# EAGLE design schemat (EAGLE 8.6.0)
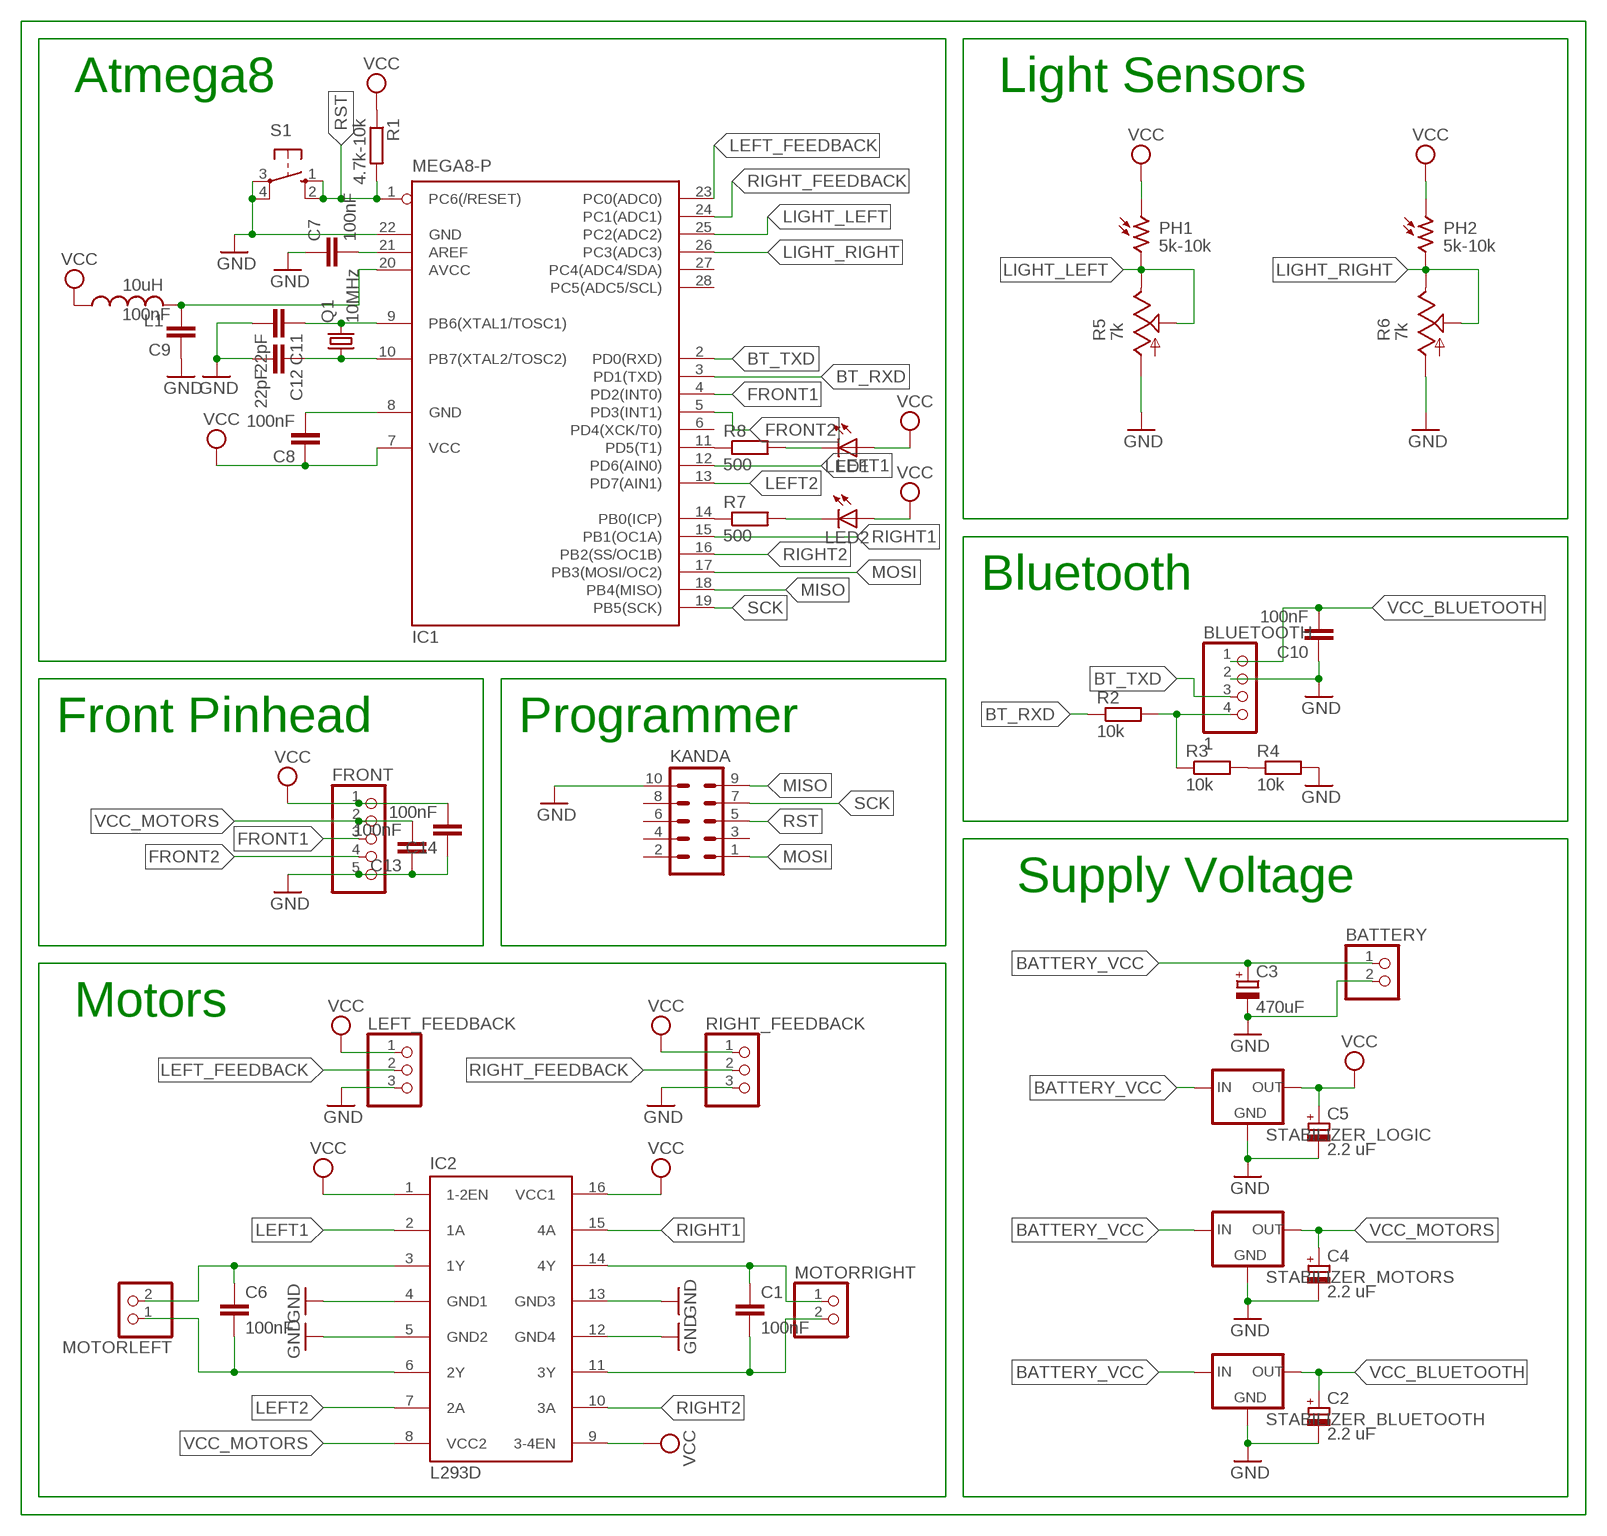
[diagram p0: schematic, sheet 1]

## Parts
BATTERY  PINHD-1X2  [1X02]
BLUETOOTH  1  PINHD-1X4  [1X04]
C1  100nF  C2,5-3  [C2.5-3]
C2  2.2 uF  CPOL-EUE1.8-4  [E1,8-4]
C3  470uF  CPOL-EUE3.5-8  [E3,5-8]
C4  2.2 uF  CPOL-EUE1.8-4  [E1,8-4]
C5  2.2 uF  CPOL-EUE1.8-4  [E1,8-4]
C6  100nF  C2,5-3  [C2.5-3]
C7  100nF  C2,5-3  [C2.5-3]
C8  100nF  C2,5-3  [C2.5-3]
C9  100nF  C2,5-3  [C2.5-3]
C10  100nF  C2,5-3  [C2.5-3]
C11  22pF  C2,5-3  [C2.5-3]
C12  22pF  C2,5-3  [C2.5-3]
C13  100nF  C2,5-3  [C2.5-3]
C14  100nF  C2,5-3  [C2.5-3]
FRONT  PINHD-1X5  [1X05]
IC1  MEGA8-P  [DIL28-3]
IC2  L293D  [DIL16]
KANDA  ML10  [ML10]
L1  10uH  L-US0204/7  [0204/7]
LED1  LEDSFH480  [SFH480]
LED2  LEDSFH480  [SFH480]
LEFT_FEEDBACK  PINHD-1X3  [1X03]
MOTORLEFT  PINHD-1X2  [1X02]
MOTORRIGHT  PINHD-1X2  [1X02]
PH1  5k-10k  VT83N2  [VT800]
PH2  5k-10k  VT83N2  [VT800]
Q1  10MHz  CRYSTALHC49U-V  [HC49U-V]
R1  4.7k-10k  R-EU_0204/7  [0204/7]
R2  10k  R-EU_0204/7  [0204/7]
R3  10k  R-EU_0204/7  [0204/7]
R4  10k  R-EU_0204/7  [0204/7]
R5  7k  TRIM_US-CA6V  [CA6V]
R6  7k  TRIM_US-CA6V  [CA6V]
R7  500  R-EU_0204/7  [0204/7]
R8  500  R-EU_0204/7  [0204/7]
RIGHT_FEEDBACK  PINHD-1X3  [1X03]
S1  10-XX  [B3F-10XX]
STABILIZER_BLUETOOTH  78XXS  [78XXS]
STABILIZER_LOGIC  78XXS  [78XXS]
STABILIZER_MOTORS  78XXS  [78XXS]

## Nets
BATTERY_VCC: BATTERY.1 C3.+ STABILIZER_BLUETOOTH.IN STABILIZER_LOGIC.IN STABILIZER_MOTORS.IN
BT_RXD: IC1.3(PD1(TXD)) R2.1
BT_TXD: BLUETOOTH.3 IC1.2(PD0(RXD))
FRONT1: FRONT.3 IC1.4(PD2(INT0))
FRONT2: FRONT.4 IC1.5(PD3(INT1))
GND: BATTERY.2 BLUETOOTH.2 C2.- C3.- C4.- C5.- C7.1 C9.1 C10.1 C11.2 C12.2 C13.1 C14.1 FRONT.5 IC1.22(GND) IC2.4(GND1) IC2.5(GND2) IC2.12(GND4) IC2.13(GND3) KANDA.10 LEFT_FEEDBACK.3 R4.2 R5.A R6.A RIGHT_FEEDBACK.3 S1.3(P) S1.4(P1) STABILIZER_BLUETOOTH.GND STABILIZER_LOGIC.GND STABILIZER_MOTORS.GND
LEFT1: IC1.12(PD6(AIN0)) IC2.2(1A)
LEFT2: IC1.13(PD7(AIN1)) IC2.7(2A)
LEFT_FEEDBACK: IC1.23(PC0(ADC0)) LEFT_FEEDBACK.2
LIGHT_LEFT: IC1.25(PC2(ADC2)) PH1.2 R5.E R5.S
LIGHT_RIGHT: IC1.26(PC3(ADC3)) PH2.2 R6.E R6.S
MISO: IC1.18(PB4(MISO)) KANDA.9
MOSI: IC1.17(PB3(MOSI/OC2)) KANDA.1
N$2: C7.2 IC1.21(AREF)
N$3: C6.1 IC2.3(1Y) MOTORLEFT.2
N$4: C6.2 IC2.6(2Y) MOTORLEFT.1
N$5: C1.1 IC2.14(4Y) MOTORRIGHT.1
N$6: C1.2 IC2.11(3Y) MOTORRIGHT.2
N$7: C9.2 IC1.20(AVCC) L1.2
N$8: C8.2 IC1.8(GND)
N$9: R3.2 R4.1
N$10: BLUETOOTH.4 R2.2 R3.1
N$12: C12.1 IC1.10(PB7(XTAL2/TOSC2)) Q1.1
N$13: C11.1 IC1.9(PB6(XTAL1/TOSC1)) Q1.2
N$20: IC1.14(PB0(ICP)) R7.1
N$21: IC1.11(PD5(T1)) R8.1
N$22: LED2.K(C) R7.2
N$23: LED1.K(C) R8.2
RIGHT1: IC1.15(PB1(OC1A)) IC2.15(4A)
RIGHT2: IC1.16(PB2(SS/OC1B)) IC2.10(3A)
RIGHT_FEEDBACK: IC1.24(PC1(ADC1)) RIGHT_FEEDBACK.2
RST: IC1.1(PC6(/RESET)) KANDA.5 R1.2 S1.1(S) S1.2(S1)
SCK: IC1.19(PB5(SCK)) KANDA.7
VCC: C5.+ C8.1 C14.2 FRONT.1 IC1.7(VCC) IC2.1(1-2EN) IC2.9(3-4EN) IC2.16(VCC1) L1.1 LED1.A LED2.A LEFT_FEEDBACK.1 PH1.1 PH2.1 R1.1 RIGHT_FEEDBACK.1 STABILIZER_LOGIC.OUT
VCC_BLUETOOTH: BLUETOOTH.1 C2.+ C10.2 STABILIZER_BLUETOOTH.OUT
VCC_MOTORS: C4.+ C13.2 FRONT.2 IC2.8(VCC2) STABILIZER_MOTORS.OUT
Unconnected: IC1.6(PD4(XCK/T0)) IC1.27(PC4(ADC4/SDA)) IC1.28(PC5(ADC5/SCL)) KANDA.2 KANDA.3 KANDA.4 KANDA.6 KANDA.8

## Notes on the sheet
- Atmega8 | Light Sensors
- Bluetooth
- Front Pinhead | Programmer
- Supply Voltage
- Motors

## Library data of the parts
BATTERY MOTORLEFT MOTORRIGHT = pinhead:PINHD-1X2: PIN HEADER
BLUETOOTH = pinhead:PINHD-1X4: PIN HEADER
C1 C6-C14 = capacitor-wima:C: CAPACITOR naming: grid - package width
C2-C5 = rcl:CPOL-EU: POLARIZED CAPACITOR, European symbol; SPICEPREFIX: C
FRONT = pinhead:PINHD-1X5: PIN HEADER
IC1 = atmel:MEGA8-P: MICROCONTROLLER 8 Kbytes FLASH, 1 kbytes SRAM, 512 bytes EEPROM, USART, 4-channel 10 bit ADC, 2-channel 8 bit ADC Pin compatible with Atmega48, ATMega88, ATMega168 Source: avr.lbr; OC_FARNELL: unknown; OC_NEWARK: unknown
IC2 = st-microelectronics:L293D: PUSH-PULL 4 CHANNEL DRIVER; MPN: L293D; OC_FARNELL: 9589619; OC_NEWARK: 56P8249
KANDA = con-ml:ML10: HARTING; OC_FARNELL: unknown; OC_NEWARK: unknown
L1 = rcl:L-US: INDUCTOR, American symbol; SPICEPREFIX: L
LED1 LED2 = led:LED: LED OSRAM: - CHIPLED LG R971, LG N971, LY N971, LG Q971, LY Q971, LO R971, LY R971 LH N974, LH R974 LS Q976, LO Q976, LY Q976 LO Q996 - Hyper CHIPLED LW Q18S LB Q993, LB Q99A, LB R99A - SideLED LS A670, LO A670, LY A670, LG A670, LP A670 LB A673, LV A673, LT A673, LW A673 LH A674 LY A675 LS A676, LA A676, LO A676, LY A676, LW A676 LS A679, LY A679, LG A679 - Hyper Micro SIDELED® LS Y876, LA Y876, LO Y876, LY Y876 LT Y87S - SmartLED LW L88C, LW L88S LB L89C, LB L89S, LG L890 LS L89K, LO L89K, LY L89K LS L896, LA L896, LO L896, LY L896 - TOPLED LS T670, LO T670, LY T670, LG T670, LP T670 LSG T670, LSP T670, LSY T670, LOP T670, LYG T670 LG T671, LOG T671, LSG T671 LB T673, LV T673, LT T673, LW T673 LH T674 LS T676, LA T676, LO T676, LY T676, LB T676, LH T676, LSB T676, LW T676 LB T67C, LV T67C, LT T67C, LS T67K, LO T67K, LY T67K, LW E67C LS E67B, LA E67B, LO E67B, LY E67B, LB E67C, LV E67C, LT E67C LW T67C LS T679, LY T679, LG T679 LS T770, LO T770, LY T770, LG T770, LP T770 LB T773, LV T773, LT T773, LW T773 LH T774 LS E675, LA E675, LY E675, LS T675 LS T776, LA T776, LO T776, LY T776, LB T776 LHGB T686 LT T68C, LB T68C - Hyper Mini TOPLED® LB M676 - Mini TOPLED Santana® LG M470 LS M47K, LO M47K, LY M47K Source: http://www.osram.convergy.de LUXEON: - LUMILED® LXK2-PW12-R00, LXK2-PW12-S00, LXK2-PW14-U00, LXK2-PW14-V00 LXK2-PM12-R00, LXK2-PM12-S00, LXK2-PM14-U00 LXK2-PE12-Q00, LXK2-PE12-R00, LXK2-PE12-S00, LXK2-PE14-T00, LXK2-PE14-U00 LXK2-PB12-K00, LXK2-PB12-L00, LXK2-PB12-M00, LXK2-PB14-N00, LXK2-PB14-P00, LXK2-PB14-Q00 LXK2-PR12-L00, LXK2-PR12-M00, LXK2-PR14-Q00, LXK2-PR14-R00 LXK2-PD12-Q00, LXK2-PD12-R00, LXK2-PD12-S00 LXK2-PH12-R00, LXK2-PH12-S00 LXK2-PL12-P00, LXK2-PL12-Q00, LXK2-PL12-R00 Source: www.luxeon.com KINGBRIGHT: KA-3528ASYC Source: www.kingbright.com
LEFT_FEEDBACK RIGHT_FEEDBACK = pinhead:PINHD-1X3: PIN HEADER
PH1 PH2 = photo-elements:VT8: Photoconductive Cell VT800 Series Source: http://optoelectronics.perkinelmer.com/content/Datasheets/DTS_vt800seriesdatasheet.pdf
Q1 = crystal:CRYSTAL: CRYSTAL; OC_FARNELL: 1666969; OC_NEWARK: unknown
R1-R4 R7 R8 = rcl:R-EU_: RESISTOR, European symbol; SPICEPREFIX: R
R5 R6 = pot:TRIM_US-: POTENTIOMETER
S1 = switch-omron:10-XX: OMRON SWITCH; MPN: B3F-1000; OC_FARNELL: 176432; OC_NEWARK: 36M3542
STABILIZER_BLUETOOTH STABILIZER_LOGIC STABILIZER_MOTORS = v-reg:78XXS: VOLTAGE REGULATOR

## Board
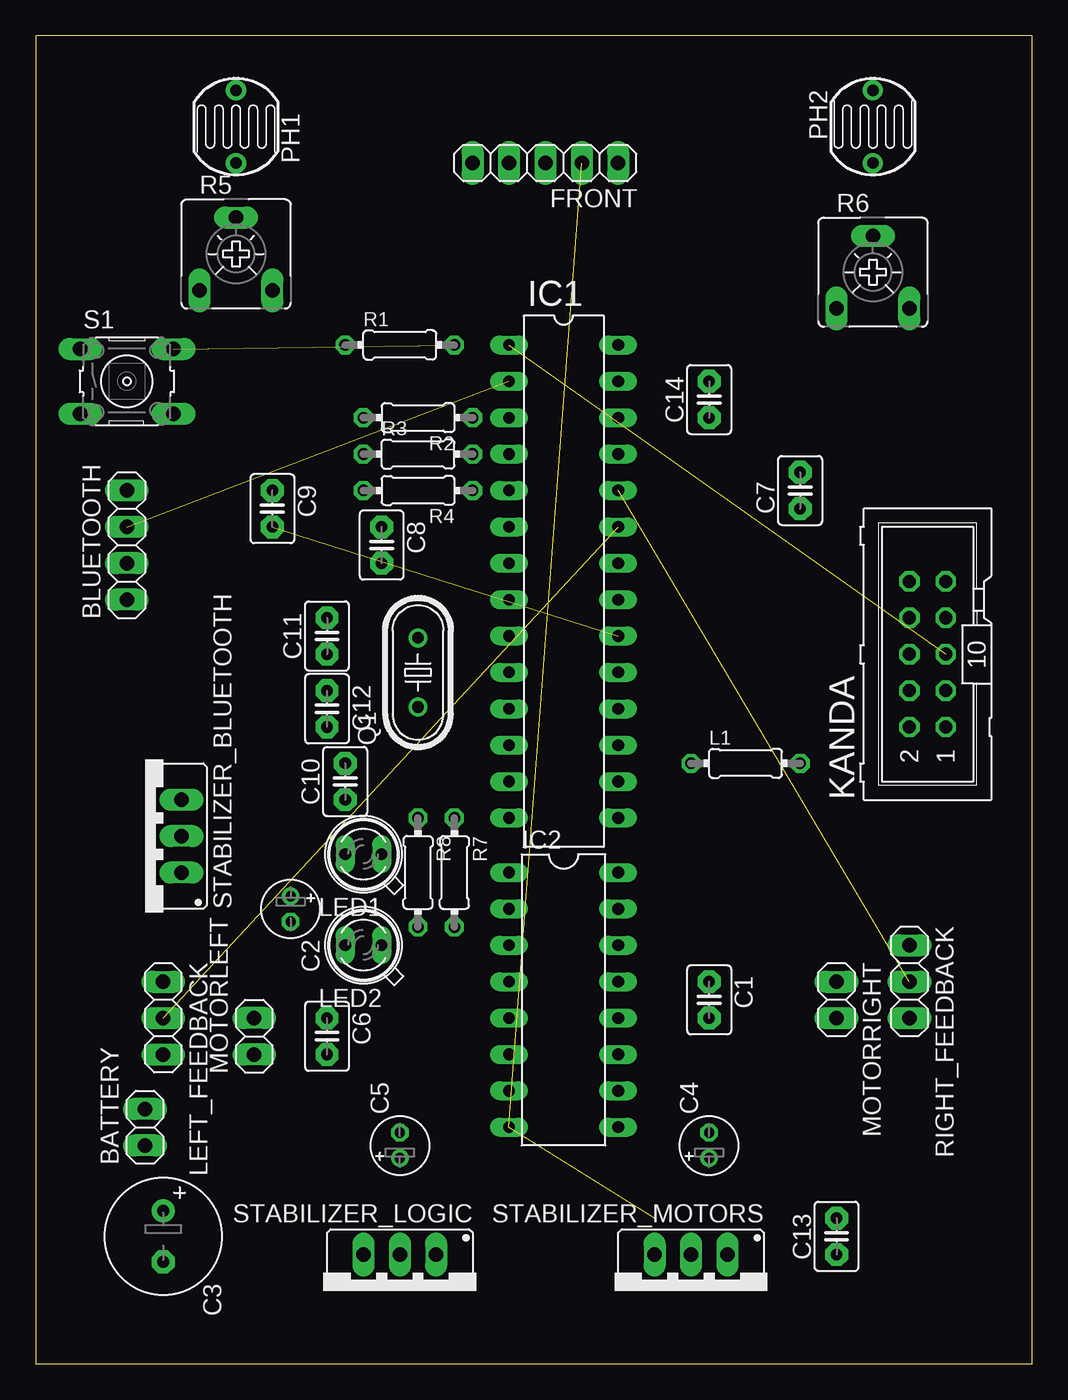
[diagram p1: board, top side]
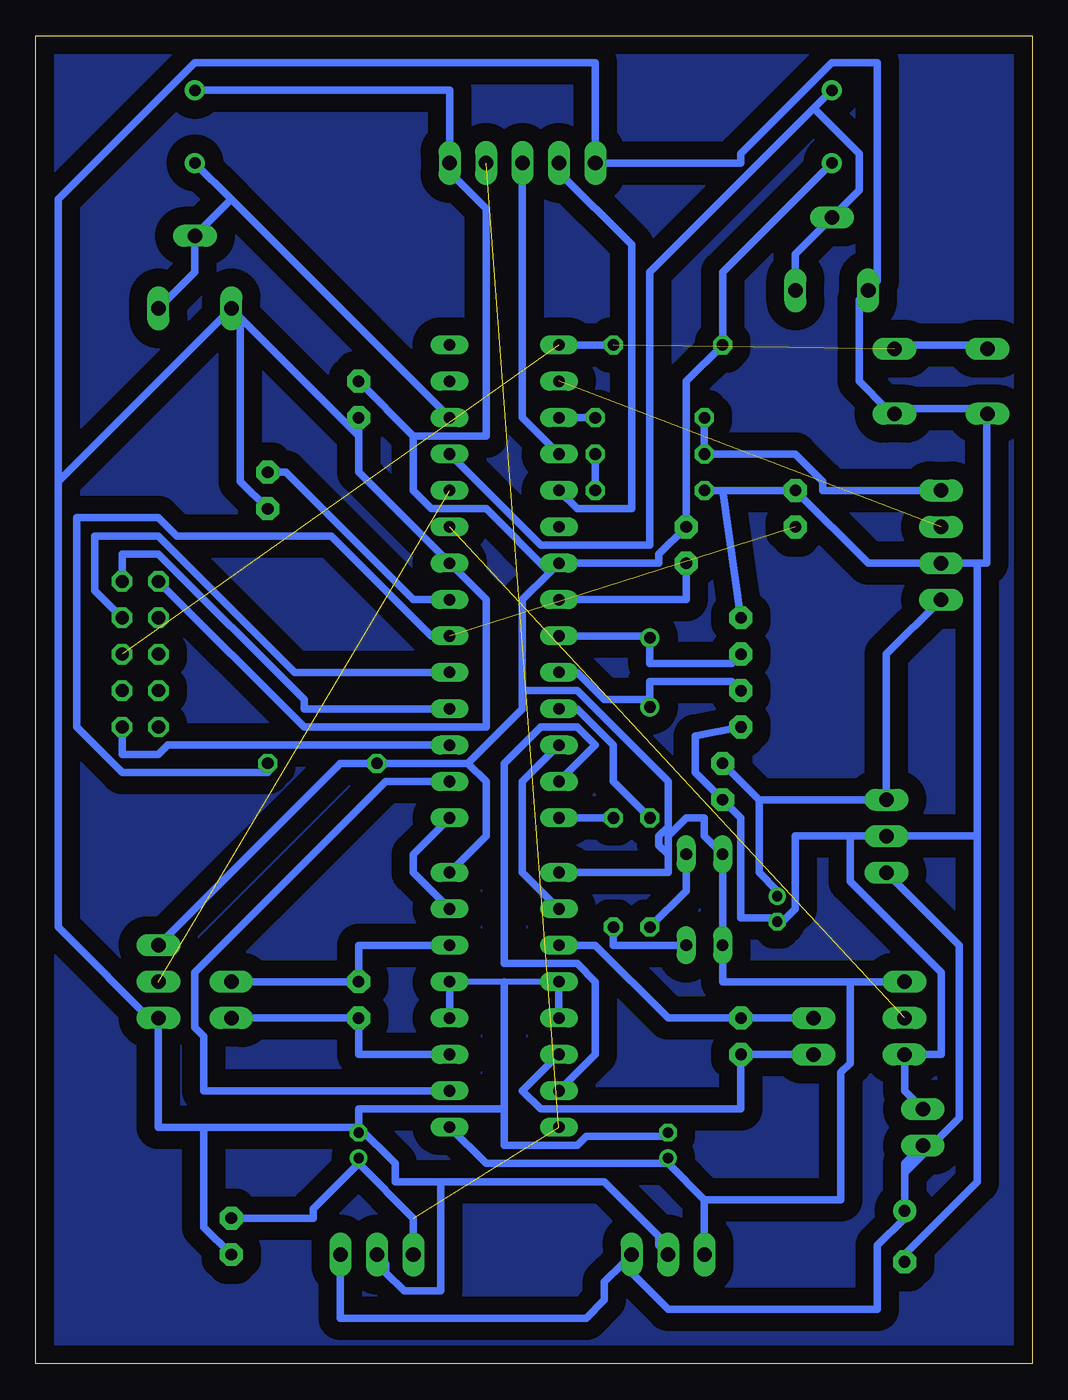
[diagram p2: board, bottom side, seen from below]

Size 69.52 x 92.7 mm. Coordinates in mm from the lower left corner, seen from the top.
Outline: 0,0 69.52,0 69.52,92.7 0,92.7 0,0
Copper layers (1*16): Top 0.035mm / dielectric 1.5mm / Bottom 0.035mm
Design rules "default *": minimum track width 20mil, minimum drill 24mil, track to track 14mil, track to pad 14mil, pad to pad 14mil, via to via 8mil, smd to smd 8mil, copper to edge 40mil, drill to drill 8mil, minimum pad ring 10mil, minimum via ring 8mil, stop-mask expansion 4mil, vias tented up to drill 0mil, thermal gap 10mil

### Footprints (pad centres in the part's own frame; a part is rotated, then mirrored left to right if it is on the bottom)
1X02 = drill 1.016 long: 1 -1.27,0; 2 1.27,0
1X04 = drill 1.016 long: 1 -3.81,0; 2 -1.27,0; 3 1.27,0; 4 3.81,0
C2.5-3 = drill 0.813 pad 1.6 octagon: 1 -1.27,0; 2 1.27,0
E1,8-4 = drill 0.711 pad 1.168: + -0.889,0 | drill 0.711 pad 1.168 octagon: - 0.889,0
E3,5-8 = drill 0.813 pad 1.6: + -1.778,0 | drill 0.813 pad 1.6 octagon: - 1.778,0
1X05 = drill 1.016 long: 1 -5.08,0; 2 -2.54,0; 3 0,0; 4 2.54,0; 5 5.08,0
DIL28-3 = drill 0.813 long: 1 -16.51,-3.81; 2 -13.97,-3.81; 3 -11.43,-3.81; 4 -8.89,-3.81; 5 -6.35,-3.81; 6 -3.81,-3.81; 7 -1.27,-3.81; 8 1.27,-3.81; 9 3.81,-3.81; 10 6.35,-3.81; 11 8.89,-3.81; 12 11.43,-3.81; 13 13.97,-3.81; 14 16.51,-3.81; 15 16.51,3.81; 16 13.97,3.81; 17 11.43,3.81; 18 8.89,3.81; 19 6.35,3.81; 20 3.81,3.81; 21 1.27,3.81; 22 -1.27,3.81; 23 -3.81,3.81; 24 -6.35,3.81; 25 -8.89,3.81; 26 -11.43,3.81; 27 -13.97,3.81; 28 -16.51,3.81
DIL16 = drill 0.813 long: 1 -8.89,-3.81; 2 -6.35,-3.81; 3 -3.81,-3.81; 4 -1.27,-3.81; 5 1.27,-3.81; 6 3.81,-3.81; 7 6.35,-3.81; 8 8.89,-3.81; 9 8.89,3.81; 10 6.35,3.81; 11 3.81,3.81; 12 1.27,3.81; 13 -1.27,3.81; 14 -3.81,3.81; 15 -6.35,3.81; 16 -8.89,3.81
ML10 = drill 0.914 octagon: 1 -5.08,-1.27; 2 -5.08,1.27; 3 -2.54,-1.27; 4 -2.54,1.27; 5 0,-1.27; 6 0,1.27; 7 2.54,-1.27; 8 2.54,1.27; 9 5.08,-1.27; 10 5.08,1.27
0204/7 = drill 0.813 octagon: 1 -3.81,0; 2 3.81,0
SFH480 = drill 0.813 long: A 1.27,0; K -1.27,0
1X03 = drill 1.016 long: 1 -2.54,0; 2 0,0; 3 2.54,0
VT800 = drill 0.8 pad 1.4: 1 -2.54,0; 2 2.54,0
HC49U-V = drill 0.813: 1 -2.413,0; 2 2.413,0
CA6V = drill 1.016 long: A -2.54,-2.54; E 2.54,-2.54; S 0,2.54
B3F-10XX = drill 1.016 long: 1 -3.251,2.261; 2 3.251,2.261; 3 -3.251,-2.261; 4 3.251,-2.261
78XXS = drill 1.016 long: GND 0,-2.54; IN -2.54,-2.54; OUT 2.54,-2.54

### Placement (x,y rotation side)
BATTERY  7.62,16.51 90 top
BLUETOOTH  6.35,57.15 90 top
C1  46.99,25.4 270 top
C2  17.78,31.75 270 top
C3  8.89,8.89 270 top
C4  46.99,15.24 90 top
C5  25.4,15.24 90 top
C6  20.32,22.86 270 top
C7  53.34,60.96 90 top
C8  24.13,57.15 270 top
C9  16.51,59.69 270 top
C10  21.59,40.64 90 top
C11  20.32,50.8 90 top
C12  20.32,45.72 270 top
C13  55.88,8.89 90 top
C14  46.99,67.31 90 top
FRONT  35.56,83.82 180 top
IC1  36.83,54.61 270 top
IC2  36.83,25.4 270 top
KANDA  62.23,49.53 90 top
L1  49.53,41.91 0 top
LED1  22.86,35.56 180 top
LED2  22.86,29.21 180 top
LEFT_FEEDBACK  8.89,24.13 270 top
MOTORLEFT  15.24,22.86 90 top
MOTORRIGHT  55.88,25.4 270 top
PH1  13.97,86.36 90 top
PH2  58.42,86.36 270 top
Q1  26.67,48.26 90 top
R1  25.4,71.12 0 top
R2  26.67,66.04 180 top
R3  26.67,63.5 0 top
R4  26.67,60.96 180 top
R5  13.97,77.47 0 top
R6  58.42,76.2 0 top
R7  29.21,34.29 270 top
R8  26.67,34.29 270 top
RIGHT_FEEDBACK  60.96,26.67 270 top
S1  6.35,68.58 0 top
STABILIZER_BLUETOOTH  7.62,36.83 90 top
STABILIZER_LOGIC  25.4,5.08 180 top
STABILIZER_MOTORS  45.72,5.08 180 top

### Tracks (layer width: path | path; a pad name or v marks a point on that pad's centre or on a via)
BATTERY_VCC
  Bottom 0.508: 28.57,6.99 29.84,5.71 29.84,4.45 31.11,3.17 48.26,3.17 STABILIZER_MOTORS.IN | BATTERY.1 8.89,13.97 8.89,13.34 | 8.89,13.34 C3.+ 8.89,10.16 10.8,8.26 10.8,3.81 25.4,3.81 28.57,6.99 | STABILIZER_BLUETOOTH.IN 5.08,29.21 5.08,17.14 8.89,13.34 | 28.57,6.99 STABILIZER_LOGIC.IN
BT_RXD
  Bottom 0.508: IC1.3 R2.1
BT_TXD  (1 unrouted)
FRONT1
  Bottom 0.508: IC1.4 35.56,66.04 FRONT.3
FRONT2
  Bottom 0.508: IC1.5 31.75,59.69 27.94,59.69 27.94,78.11 33.02,83.19 FRONT.4
GND
  Bottom 0.406: IC2.4 36.83,26.67 IC2.13
  Bottom 0.508: C14.1 46.99,64.77 | 46.99,64.77 46.99,62.23 IC1.22 38.1,53.34 38.1,44.45 50.8,44.45 KANDA.10 | 46.99,64.77 55.24,73.03 | C7.1 55.24,61.59 55.24,73.03 | 55.24,73.03 R6.A 67.95,61.59 | 36.83,26.67 36.83,17.78 | 36.83,17.78 36.83,15.24 31.75,15.24 31.11,15.88 25.4,15.88 C5.- | IC2.4 IC2.5 | IC2.13 IC2.12 | 57.78,16.51 60.96,16.51 60.96,23.5 | 57.78,16.51 46.99,16.51 | STABILIZER_LOGIC.GND 26.04,8.26 26.04,8.89 29.84,12.7 41.27,12.7 | 41.27,12.7 44.45,12.7 44.45,13.97 46.99,16.51 | STABILIZER_MOTORS.GND 45.09,6.99 45.09,6.35 43.81,5.08 41.27,5.08 41.27,12.7 | C13.1 57.78,9.53 57.78,16.51 | 36.83,17.78 46.99,17.78 46.99,16.51 | 46.99,16.51 C4.- | 67.95,61.59 67.95,30.48 60.96,23.5 | 60.96,23.5 RIGHT_FEEDBACK.3 | BATTERY.2 8.89,19.05 LEFT_FEEDBACK.3 6.35,21.59 6.35,27.3 12.7,33.66 12.7,36.83 | 12.7,36.83 16.51,36.83 16.51,31.75 17.78,30.48 C2.- 17.78,31.11 20.32,31.11 20.32,38.1 C10.1 23.49,41.27 23.49,43.81 C12.2 | 12.7,36.83 STABILIZER_BLUETOOTH.GND 3.81,36.83 | 21.59,60.96 C9.1 11.43,55.88 BLUETOOTH.2 3.81,55.88 | 21.59,60.96 R4.2 | 21.59,60.96 C11.2 | 3.81,55.88 3.17,55.88 3.17,66.04 S1.3 3.17,66.67 9.53,66.67 S1.4 10.16,66.67 12.07,68.58 12.07,74.3 R5.A 10.8,75.56 10.8,90.81 13.97,90.81 20.32,84.45 20.32,83.82 FRONT.5 30.48,90.81 58.42,90.81 67.95,81.28 67.95,61.59 | 3.81,55.88 3.81,36.83 | 3.81,36.83 3.81,12.7 8.89,7.62 C3.-
LEFT1
  Bottom 0.508: IC2.2 35.56,34.29 35.56,40.64 IC1.12
LEFT2
  Bottom 0.508: IC2.7 30.48,21.59 30.48,26.67 31.75,27.94 36.83,27.94 36.83,41.91 34.29,44.45 31.75,44.45 30.48,43.18 IC1.13
LEFT_FEEDBACK  (1 unrouted)
LIGHT_LEFT
  Bottom 0.508: R5.E 16.51,77.47 R5.S 12.07,81.92 12.07,84.45 15.24,87.63 | IC1.25 34.29,57.15 26.67,57.15 26.67,76.2 15.24,87.63 | PH1.2 15.24,87.63
LIGHT_RIGHT
  Bottom 0.508: PH2.2 55.88,81.28 | 55.88,81.28 IC1.26 | 55.88,81.28 R6.S 58.42,76.2 R6.E
MISO
  Bottom 0.508: IC1.18 50.8,45.72 50.8,46.35 60.96,56.52 63.5,56.52 KANDA.9
MOSI
  Bottom 0.508: IC1.17 60.32,43.18 60.96,42.55 63.5,42.55 KANDA.1
N$1
  pour Bottom (isolate 1.27): 0,92.71 0,0 69.85,0 69.85,92.71
N$2
  Bottom 0.508: IC1.21 43.18,53.34 52.07,62.23 C7.2
N$3
  Bottom 0.508: IC2.3 30.48,29.21 25.4,24.13 C6.1 MOTORLEFT.2
N$4
  Bottom 0.508: IC2.6 35.56,19.05 34.29,17.78 20.32,17.78 C6.2 MOTORLEFT.1
N$5
  Bottom 0.508: IC2.14 46.99,29.21 C1.1 MOTORRIGHT.1
N$6
  Bottom 0.508: IC2.11 46.99,21.59 C1.2 MOTORRIGHT.2
N$7  (1 unrouted)
  Bottom 0.508: IC1.20 41.91,50.8 48.89,57.78 59.69,57.78 60.96,59.05 66.68,59.05 66.68,44.45 63.5,41.27 53.34,41.27 L1.2
N$8
  Bottom 0.508: IC1.8 24.13,53.34 C8.2
N$9
  Bottom 0.508: R3.2 R4.1
N$10
  Bottom 0.508: R2.2 R3.1 16.51,63.5 14.61,61.59 14.61,60.96 BLUETOOTH.4
N$12
  Bottom 0.508: 26.67,46.35 29.84,46.35 31.75,48.26 IC1.10 | C12.1 20.95,47.62 26.67,47.62 26.67,46.35 | 26.67,46.35 Q1.1
N$13
  Bottom 0.508: IC1.9 26.67,50.8 Q1.2 26.67,48.9 20.95,48.9 C11.1
N$20
  Bottom 0.508: IC1.14 R7.1
N$21
  Bottom 0.508: R8.1 29.21,40.64 29.21,43.18 31.75,45.72 IC1.11
N$22
  Bottom 0.508: LED2.K 29.21,29.21 R7.2
N$23
  Bottom 0.508: R8.2 24.13,33.02 LED1.K
RIGHT1
  Bottom 0.508: IC2.15 43.18,34.29 43.18,35.56 IC1.15
RIGHT2
  Bottom 0.508: IC2.10 57.78,19.05 57.78,22.86 58.42,23.5 58.42,27.3 45.09,40.64 IC1.16
RIGHT_FEEDBACK  (1 unrouted)
RST  (2 unrouted)
  Bottom 0.508: S1.1 3.17,71.12 9.53,71.12 S1.2 | IC1.1 R1.2
SCK
  Bottom 0.508: IC1.19 51.44,48.26 60.96,57.78 65.41,57.78 65.41,53.98 KANDA.7
VCC
  Bottom 0.508: 22.86,11.43 25.4,13.97 | STABILIZER_LOGIC.OUT 22.86,11.43 | IC2.9 38.1,13.97 25.4,13.97 | 25.4,13.97 C5.+ | IC2.1 25.4,34.29 25.4,35.56 | 25.4,35.56 25.4,36.83 24.13,38.1 22.86,38.1 22.86,36.83 LED1.A LED2.A 21.59,26.67 12.7,26.67 | 12.7,26.67 LEFT_FEEDBACK.1 | 22.86,11.43 13.34,11.43 13.34,20.32 12.7,20.95 12.7,26.67 | PH2.1 40.64,88.9 FRONT.1 40.64,83.19 38.1,80.64 38.1,64.77 43.18,64.77 | 43.18,64.77 C14.2 | IC2.16 38.1,36.83 38.1,40.64 39.37,41.91 | 39.37,41.91 L1.1 48.26,41.91 RIGHT_FEEDBACK.1 | PH1.1 21.59,76.2 R1.1 24.13,68.58 C8.1 26.04,56.52 26.04,55.88 IC1.7 33.66,55.24 | 39.37,41.91 35.56,45.72 35.56,46.99 | 35.56,46.99 35.56,53.34 33.66,55.24 | 43.18,64.77 43.18,60.96 41.91,59.69 38.1,59.69 33.66,55.24 | 25.4,35.56 26.04,36.2 26.04,36.83 25.4,37.47 25.4,40.64 31.75,46.99 35.56,46.99
VCC_BLUETOOTH
  Bottom 0.508: 19.05,39.37 19.05,34.29 17.78,33.02 C2.+ | C10.2 19.05,39.37 | 19.05,39.37 STABILIZER_BLUETOOTH.OUT 10.16,49.53 BLUETOOTH.1
VCC_MOTORS  (2 unrouted)
  Bottom 0.508: 46.99,13.97 43.18,10.16 STABILIZER_MOTORS.OUT | C13.2 50.16,10.16 50.16,10.79 46.99,13.97 | 46.99,13.97 C4.+